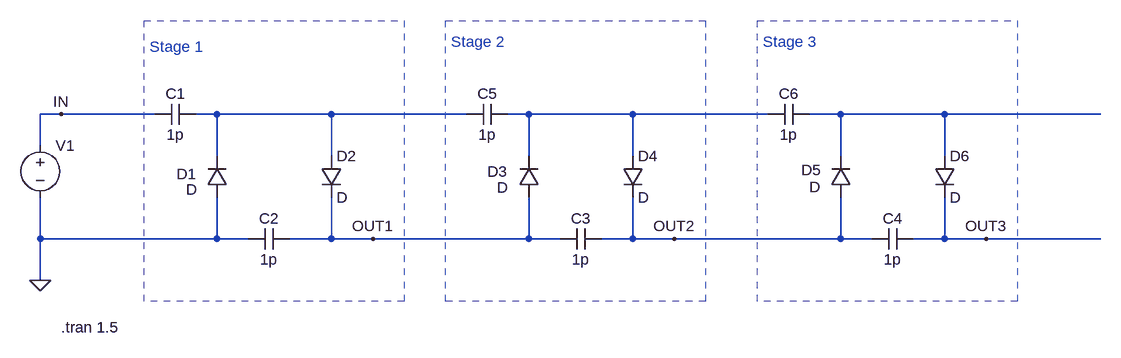
[diagram p0: schematic v1.0.asc]
v1.0.asc, the LTspice schematic file:
Version 4.1
SHEET 1 1572 680
WIRE -32 48 -64 48
WIRE 112 48 -32 48
WIRE 208 48 176 48
WIRE 384 48 208 48
WIRE 592 48 384 48
WIRE 688 48 656 48
WIRE 848 48 688 48
WIRE 1056 48 848 48
WIRE 1168 48 1120 48
WIRE 1328 48 1168 48
WIRE 1568 48 1328 48
WIRE -64 96 -64 48
WIRE 208 112 208 48
WIRE 384 112 384 48
WIRE 688 112 688 48
WIRE 848 112 848 48
WIRE 1168 112 1168 48
WIRE 1328 112 1328 48
WIRE -64 240 -64 176
WIRE 208 240 208 176
WIRE 208 240 -64 240
WIRE 256 240 208 240
WIRE 384 240 384 176
WIRE 384 240 320 240
WIRE 448 240 384 240
WIRE 688 240 688 176
WIRE 688 240 448 240
WIRE 736 240 688 240
WIRE 848 240 848 176
WIRE 848 240 800 240
WIRE 912 240 848 240
WIRE 1168 240 1168 176
WIRE 1168 240 912 240
WIRE 1216 240 1168 240
WIRE 1328 240 1328 176
WIRE 1328 240 1280 240
WIRE 1392 240 1328 240
WIRE 1568 240 1392 240
WIRE -64 304 -64 240
FLAG -64 304 0
FLAG 448 240 OUT1
FLAG 912 240 OUT2
FLAG 1392 240 OUT3
FLAG -32 48 IN
SYMBOL voltage -64 80 R0
WINDOW 3 47 66 Invisible 2
WINDOW 123 24 124 Left 2
WINDOW 39 0 0 Left 2
SYMATTR Value SINE(0 10 50)
SYMATTR InstName V1
SYMBOL diode 224 176 R180
WINDOW 0 47 36 Left 2
WINDOW 3 46 12 Left 2
SYMATTR InstName D1
SYMBOL diode 368 112 R0
SYMATTR InstName D2
SYMBOL cap 112 64 R270
WINDOW 0 32 32 VTop 2
WINDOW 3 0 32 VBottom 2
SYMATTR InstName C1
SYMATTR Value 1p
SYMBOL cap 256 256 R270
WINDOW 0 32 32 VTop 2
WINDOW 3 0 32 VBottom 2
SYMATTR InstName C2
SYMATTR Value 1p
SYMBOL diode 704 176 R180
WINDOW 0 49 40 Left 2
WINDOW 3 48 15 Left 2
SYMATTR InstName D3
SYMBOL diode 832 112 R0
SYMATTR InstName D4
SYMBOL cap 736 256 R270
WINDOW 0 32 32 VTop 2
WINDOW 3 0 32 VBottom 2
SYMATTR InstName C3
SYMATTR Value 1p
SYMBOL diode 1184 176 R180
WINDOW 0 46 42 Left 2
WINDOW 3 47 16 Left 2
SYMATTR InstName D5
SYMBOL diode 1312 112 R0
SYMATTR InstName D6
SYMBOL cap 1216 256 R270
WINDOW 0 32 32 VTop 2
WINDOW 3 0 32 VBottom 2
SYMATTR InstName C4
SYMATTR Value 1p
SYMBOL cap 592 64 R270
WINDOW 0 32 32 VTop 2
WINDOW 3 0 32 VBottom 2
SYMATTR InstName C5
SYMATTR Value 1p
SYMBOL cap 1056 64 R270
WINDOW 0 32 32 VTop 2
WINDOW 3 0 32 VBottom 2
SYMATTR InstName C6
SYMATTR Value 1p
TEXT -32 376 Left 2 !.tran 1.5
TEXT 104 -56 Left 2 ;Stage 1
TEXT 568 -64 Left 2 ;Stage 2
TEXT 1048 -64 Left 2 ;Stage 3
RECTANGLE Normal 496 336 96 -96 2
RECTANGLE Normal 960 336 560 -96 2
RECTANGLE Normal 1440 336 1040 -96 2

The netlist it stands for:
* v1.0.asc
V1 IN 0 SINE(0 10 50)
D1 0 N001 D
D2 N001 OUT1 D
C1 IN N001 1p
C2 0 OUT1 1p
D3 OUT1 N002 D
D4 N002 OUT2 D
C3 OUT1 OUT2 1p
D5 OUT2 N003 D
D6 N003 OUT3 D
C4 OUT2 OUT3 1p
C5 N001 N002 1p
C6 N002 N003 1p
.model D D
.lib standard.dio
.tran 1.5
* Stage 1
* Stage 2
* Stage 3
.backanno
.end